# Altium schematic sheet 0.1uF 50V SCH.schdoc
size 44 x 29 mm
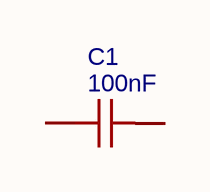
[diagram p0: 0.1uF 50V SCH.schdoc]

## Parts
C1  100nF  [C0402]

## Nets

Not connected (* = marked no-connect by the designer): C1 1 2

## Library data of the parts
C1 = 100nF: Manufacturer: SAMSUNG(三星); Manufacturer Part: CL05B104KB5NNNC; nameAlias: Value; Contributor: LCSC; Supplier: LCSC; Supplier Part: C960916; JLCPCB Part Class: Extended Part; spicePre: C; spiceSymbolName: CL05B104KB5NNNC